# EAGLE design counter-defender-esp8266-pir-mk-1.0 (EAGLE 7.5.0)
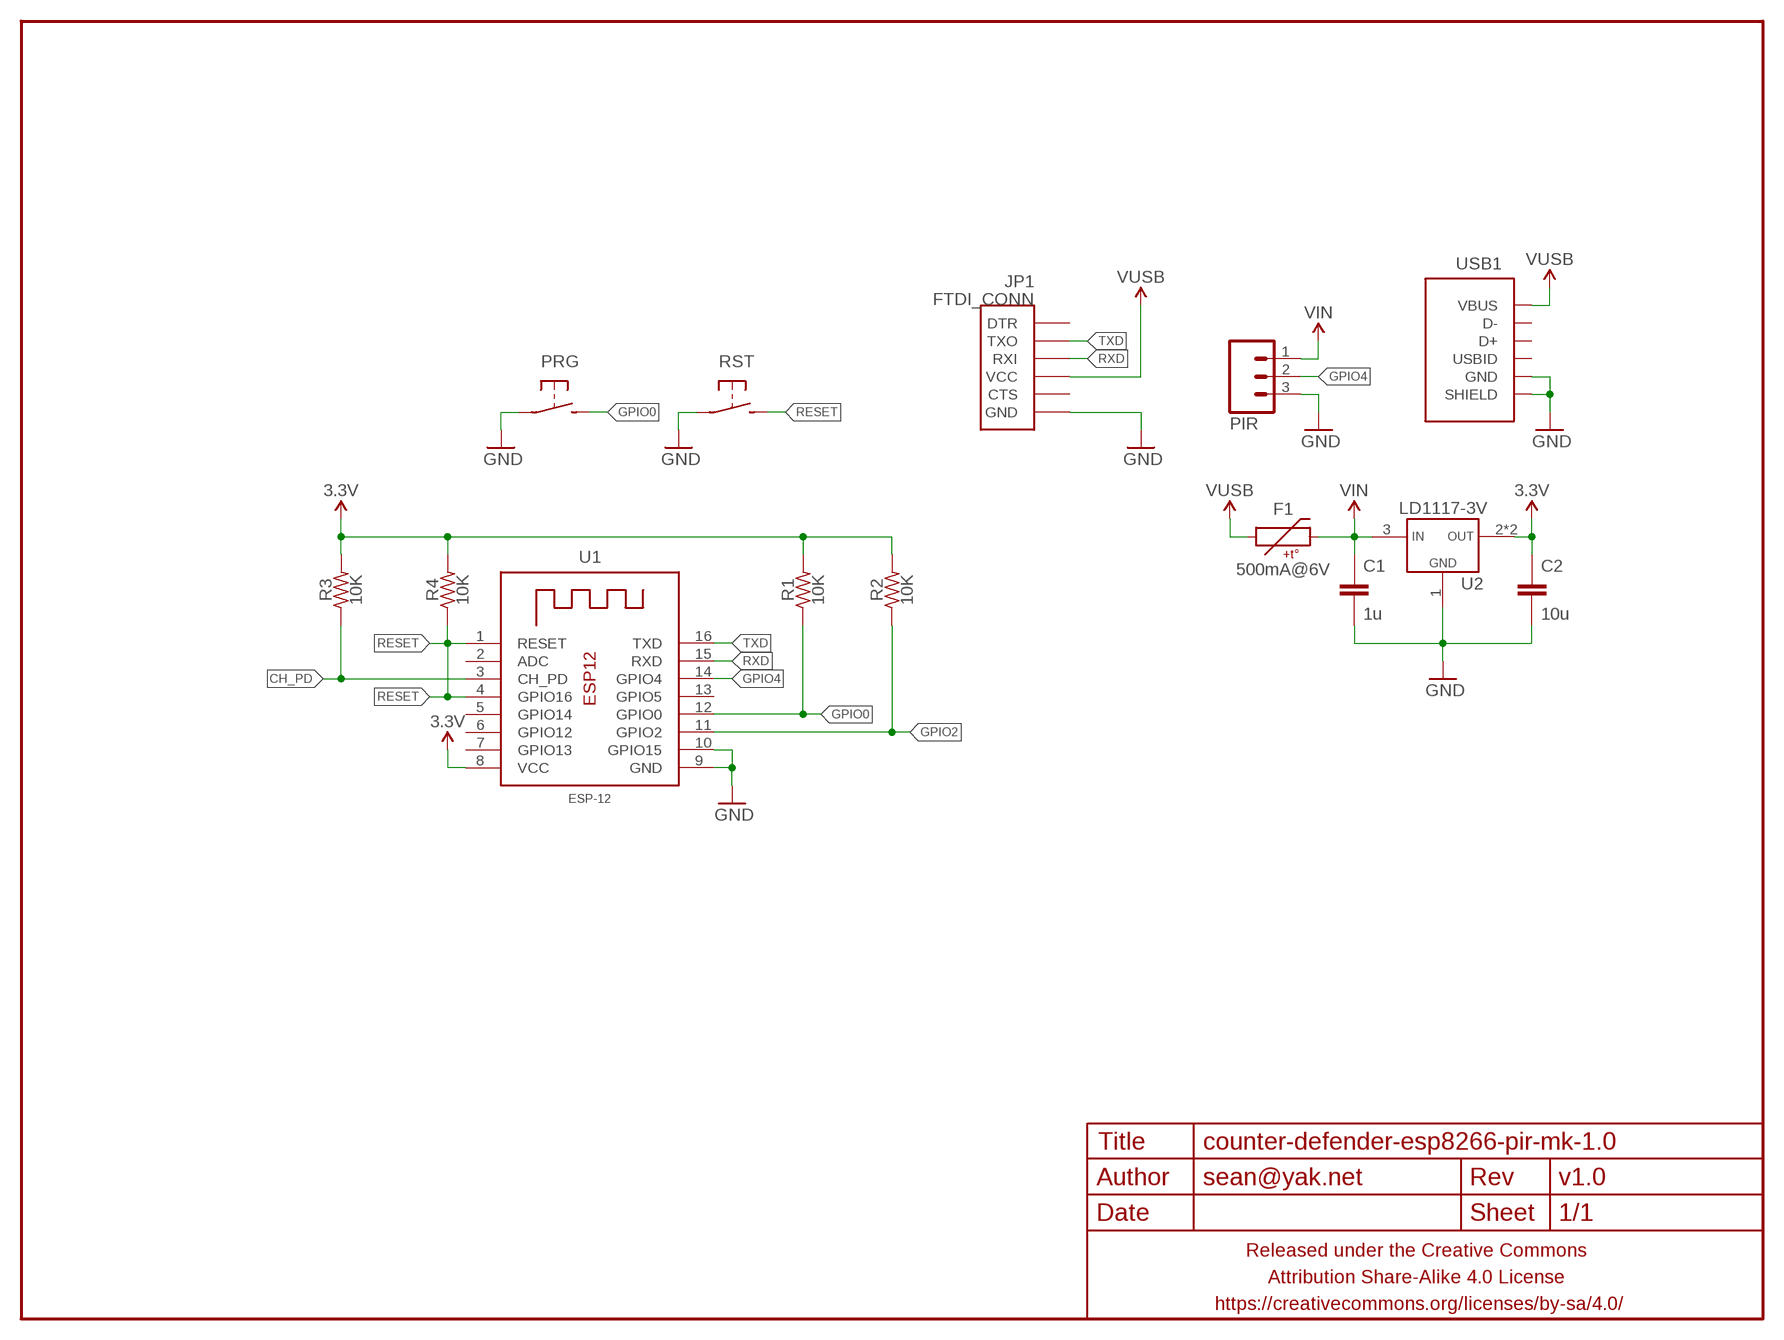
[diagram p0: schematic, sheet 1]

## Parts
C1  1u  CAPACITOR-CERAMICC0805-TIGHTER  [C0805-TIGHTER]
C2  10u  CAPACITOR-CERAMICC0805-TIGHTER  [C0805-TIGHTER]
F1  500mA@6V  PTC0805  [PTC0805]
FRAME1  FRAME-LETTERNO_PACKAGE  [DUMMY]
JP1  FTDI_CONN  [FTDI_CONN]
PIR  M03PTH-CENTERED  [1X03-CENTERED]
PRG  SPST-NO-TACTSMD-TINIER  [TACTILE_SWITCH_SMD_TINY]
R1  10K  RESISTORR0603-TIGHTER  [R0603-TIGHTER]
R2  10K  RESISTORR0603-TIGHTER  [R0603-TIGHTER]
R3  10K  RESISTORR0603-TIGHTER  [R0603-TIGHTER]
R4  10K  RESISTORR0603-TIGHTER  [R0603-TIGHTER]
RST  SPST-NO-TACTSMD-TINIER  [TACTILE_SWITCH_SMD_TINY]
U1  ESP-12  [ESP-12]
U2  LD1117-3V  VREG_1117SOT223  [SOT223]
USB1  USB-AB-SHIELDFCI-10103594-USB-MICRO-B-EVENLESS  [FCI-10103594-USB-MICRO-B-EVENLESS]

## Nets
3.3V: C2.1 R1.2 R2.2 R3.2 R4.2 U1.8(VCC) U2.2(VOUT) U2.4(VOUT)
CH_PD: R3.1 U1.3(CH_PD)
GND: C1.2 C2.2 JP1.GND PIR.3 PRG.P$1 RST.P$1 U1.9(GND) U1.10(GPIO15) U2.1(GND) USB1.5(GND) USB1.SHIELD@1(SHIELD) USB1.SHIELD@2(SHIELD) USB1.SHIELD@3(SHIELD) USB1.SHIELD@4(SHIELD) USB1.SHIELD@5(SHIELD) USB1.SHIELD@6(SHIELD)
GPIO0: PRG.P$2 R1.1 U1.12(GPIO0)
GPIO2: R2.1 U1.11(GPIO2)
GPIO4: PIR.2 U1.14(GPIO4)
RESET: R4.1 RST.P$2 U1.1(RESET) U1.4(GPIO16)
RXD: JP1.RXI U1.15(RXD)
TXD: JP1.TXO U1.16(TXD)
VIN: C1.1 F1.2 PIR.1 U2.3(VIN)
VUSB: F1.1 JP1.VCC USB1.1(VBUS)
Unconnected: JP1.CTS JP1.DTR U1.2(ADC) U1.5(GPIO14) U1.6(GPIO12) U1.7(GPIO13) U1.13(GPIO5) USB1.2(D-) USB1.3(D+) USB1.4(USBID)

## Library data of the parts
C1 C2 = a_parts:CAPACITOR-CERAMIC: CAPACITOR, European symbol
F1 = a_parts:PTC: Resettable Fuse PTC Resettable Fuse. Spark Fun Electronics SKU : COM-08357
FRAME1 = a_parts:FRAME-LETTER: Schematic Frame Standard 8.5x11 US Letter frame; DESIGNER: sean@yak.net; VERSION: v1.0
JP1 = a_parts:FTDI_CONN: Connector which mates to FTDI basic or FTDI cable.
PIR = a_parts:M03: Header 3 Standard 3-pin 0.1" header. Use with straight break away headers (SKU : PRT-00116), right angle break away headers (PRT-00553), swiss pins (PRT-00743), machine pins (PRT-00117), and female headers (PRT-00115). Molex polarized connector foot print use with SKU : PRT-08232 with associated crimp pins and housings.
PRG RST = a_parts:SPST-NO-TACT
R1-R4 = a_parts:RESISTOR: RESISTOR, American symbol
U1 = a_parts:ESP-12
U2 = a_parts:VREG_1117
USB1 = a_parts:USB-AB-SHIELD

## Board
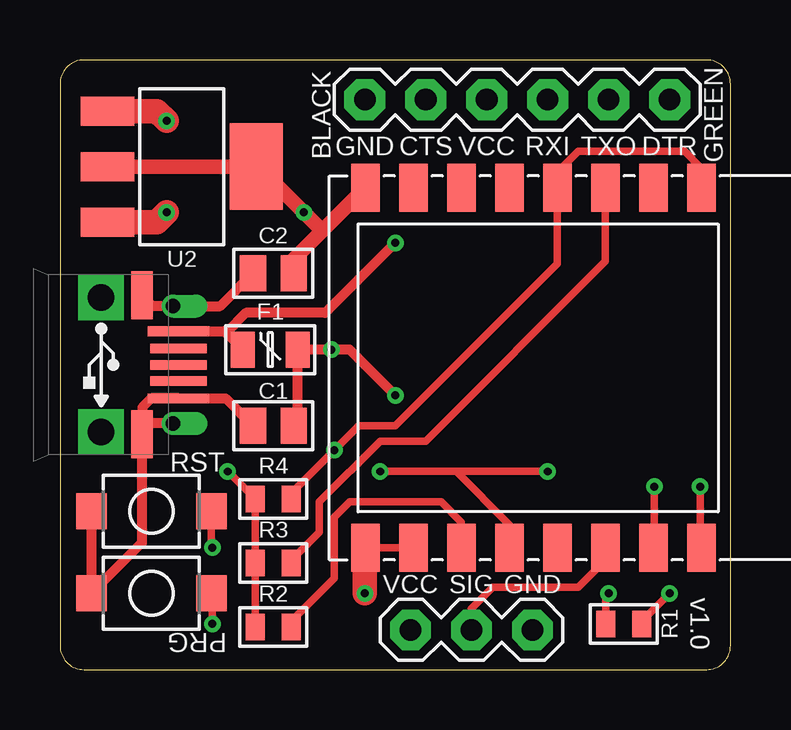
[diagram p1: board, top side]
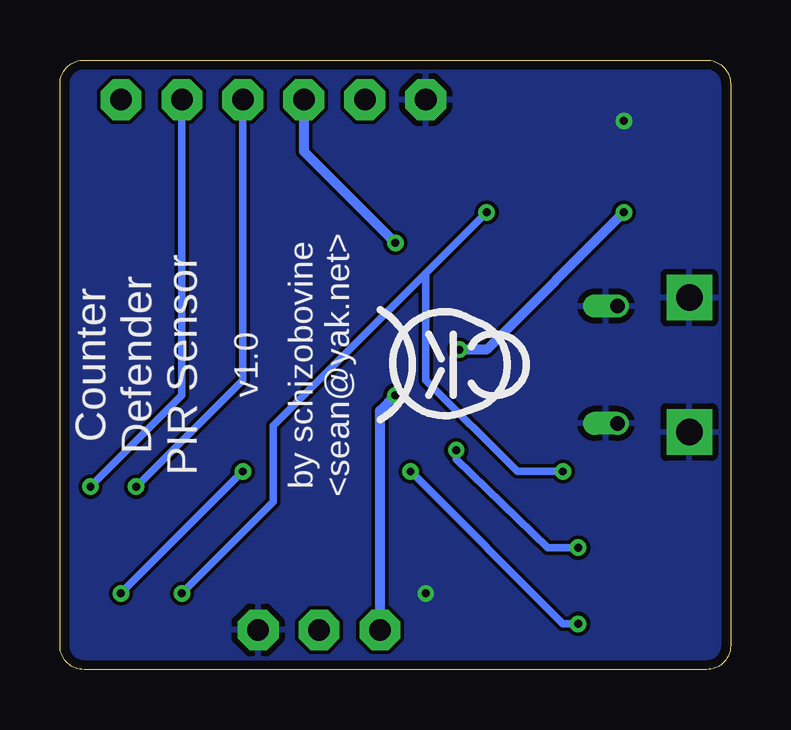
[diagram p2: board, bottom side, seen from below]

Size 27.94 x 25.4 mm. Coordinates in mm from the lower left corner, seen from the top.
Outline: 0,24.4 0,1 arc90 1,0 26.94,0 arc90 27.94,1 27.94,24.4 arc90 26.94,25.4 1,25.4 arc90 0,24.4
Copper layers (1*16): Top 0.0356mm / dielectric 1.5011mm / Bottom 0.0356mm
Design rules "LaenPCBOrder2": minimum track width 6mil, minimum drill 13mil, track to track 6mil, track to pad 6mil, pad to pad 6mil, via to via 6mil, smd to smd 6mil, copper to edge 15mil, drill to drill 6mil, minimum pad ring 7mil, minimum via ring 7mil, stop-mask expansion 3mil, vias tented up to drill 20mil, thermal gap 10mil

### Footprints (pad centres in the part's own frame; a part is rotated, then mirrored left to right if it is on the bottom)
C0805-TIGHTER = smd 1.1 x 1.5: 1 -0.85,0; 2 0.85,0
PTC0805 = smd 1 x 1.5: 1 -1.15,0; 2 1.15,0
FTDI_CONN = drill 0.9 pad 1.7 octagon: CTS 3.81,0; DTR -6.35,0; GND 6.35,0; RXI -1.27,0; TXO -3.81,0; VCC 1.27,0
1X03-CENTERED = drill 0.9 pad 1.7 octagon: 1 -2.54,0; 2 0,0; 3 2.54,0
TACTILE_SWITCH_SMD_TINY = smd 1.27 x 1.5: P$1 -2.5,0; P$2 2.5,0
R0603-TIGHTER = smd 0.8 x 1.1: 1 -0.75,0; 2 0.75,0
ESP-12 = smd 2 x 1.2: 1 -7.5,4.5; 2 -7.5,2.5; 3 -7.5,0.5; 4 -7.5,-1.5; 5 -7.5,-3.5; 6 -7.5,-5.5; 7 -7.5,-7.5; 8 -7.5,-9.5; 9 7.5,-9.5; 10 7.5,-7.5; 11 7.5,-5.5; 12 7.5,-3.5; 13 7.5,-1.5; 14 7.5,0.5; 15 7.5,2.5; 16 7.5,4.5
SOT223 = smd 1.219 x 2.235: 1 -2.311,-3.099; 2 0,-3.099; 3 2.311,-3.099 | smd 3.6 x 2.2: 4 0,3.099
FCI-10103594-USB-MICRO-B-EVENLESS = smd 0.4 x 2.55: 1 -1.4,3.225; 5 1.4,3.225 | smd 0.4 x 2.35: 2 -0.675,3.225; 3 0,3.225; 4 0.675,3.225 | drill 0.6 pad 0.9 offset: SHIELD@1 -2.445,3; SHIELD@2 2.445,3 | drill 1.1 pad 1.9 square: SHIELD@3 -2.8,0; SHIELD@4 2.8,0 | smd 2 x 0.9: SHIELD@5 -2.9,1.7; SHIELD@6 2.9,1.7

### Placement (x,y rotation side)
C1  8.89,10.16 180 top
C2  8.89,16.51 180 top
F1  8.76,13.34 0 top
FRAME1  0,0 0 top
JP1  19.05,23.75 180 top
PIR  17.14,1.65 0 top
PRG  3.81,3.17 0 top
R1  23.5,1.91 180 top
R2  8.89,1.78 180 top
R3  8.89,4.45 180 top
R4  8.89,7.11 180 top
RST  3.81,6.6 0 top
U1  22.23,12.57 270 top
U2  5.08,20.95 270 top
U$2  [COW_SMALL_NOTEXT]  12.06,12.7 90 bottom
USB1  1.71,12.7 270 top

### Tracks (layer width: path | path; a pad name or v marks a point on that pad's centre or on a via)
3.3V  (via drill 0.33)
  Top 0.305: v6.99,8.26 8.13,7.11 R4.2 R3.2 R2.2 | R1.2 22.75,3.06 v22.86,3.17
  Top 0.61: U2.2 U2.4 8.26,20.95 v10.16,19.05 10.87,18.34 10.99,18.34 | U1.8 10.99,18.34 | 10.99,18.34 9.74,17.09 C2.1
  Bottom 0.305: v6.99,8.26 8.89,8.26 12.7,12.06 12.7,16.51 | 12.7,16.51 v10.16,19.05 | v22.86,3.17 19.05,6.99 19.05,10.16 12.7,16.51
CH_PD
  Top 0.305: R3.1 9.64,4.56 10.79,5.71 10.79,6.99 13.34,9.53 15.24,9.53 22.73,17.01 U1.3
GND  (via drill 0.33)
  Top 0.305: U1.9 U1.10
  Top 0.406: RST.P$1 PRG.P$1 3.41,5.28 USB1.SHIELD@6 3.43,9.81 3.43,10.29 | 3.43,10.29 3.43,10.92 3.81,11.3 USB1.5 6.9,11.3 C1.2 | USB1.SHIELD@2 3.46,10.26 3.43,10.29 | USB1.SHIELD@5 3.87,15.14 USB1.SHIELD@1 6.67,15.14 C2.2
  Top 1.016: v4.45,22.86 4.04,23.27 U2.1 | v12.7,3.17 12.7,5.1 U1.9
  pour Bottom (rank 6): 1,0 26.94,0 arc90 27.94,1 27.94,24.4 arc90 26.94,25.4 1,25.4 arc90 0,24.4 0,1 arc90
GPIO0  (via drill 0.33)
  Top 0.305: PRG.P$2 6.35,3.13 v6.35,1.91 | v13.34,8.26 16.51,8.26 | 16.51,8.26 v20.32,8.26 | v25.4,3.17 24.25,2.02 R1.1 | U1.12 18.73,6.04 16.51,8.26
  Bottom 0.305: v6.35,1.91 6.99,1.91 v13.34,8.26 | v20.32,8.26 v25.4,3.17
GPIO2
  Top 0.305: R2.1 9.64,2.02 11.43,3.81 11.43,6.35 12.06,6.99 15.88,6.99 16.73,6.13 U1.11
GPIO4
  Top 0.305: PIR.2 17.14,2.54 18.03,3.43 21.59,3.43 22.73,4.56 U1.14
RESET  (via drill 0.33)
  Top 0.305: RST.P$2 6.31,5.12 v6.35,5.08 | R4.1 9.65,7.11 9.65,7.37 v11.43,9.14 12.45,10.16 13.97,10.16 20.73,16.91 U1.4 20.73,20.32 20.73,20.73 21.59,21.59 26.04,21.59 26.73,20.9 U1.1
  Bottom 0.305: v6.35,5.08 7.62,5.08 11.43,8.76 v11.43,9.14
RXD  (via drill 0.33)
  Top 0.305: v24.77,7.62 24.77,5.11 U1.15
  Bottom 0.305: JP1.RXI 20.32,12.06 v24.77,7.62
TXD  (via drill 0.33)
  Top 0.305: v26.67,7.62 26.67,5.13 U1.16
  Bottom 0.305: JP1.TXO 22.86,11.43 v26.67,7.62
VIN  (via drill 0.33)
  Top 0.406: C1.1 9.91,10.33 F1.2 v11.3,13.34 12.06,13.34 v13.97,11.43
  Top 1.016: U2.3 4.04,18.64 v4.45,19.05
  Bottom 0.406: v4.45,19.05 10.16,13.34 v11.3,13.34 | PIR.1 14.61,10.79 v13.97,11.43
VUSB  (via drill 0.33)
  Top 0.406: USB1.1 6.85,14.1 6.92,14.03 | 6.92,14.03 F1.1 | v13.97,17.78 11.05,14.86 7.75,14.86 6.92,14.03
  Bottom 0.406: JP1.VCC 17.78,21.59 v13.97,17.78

### Text on the board
tPlace: VCC | SIG | GND
bPlace: by schizobovine / <sean@yak.net> | Counter / Defender / PIR Sensor